# Altium schematic sheet SUP_VCCINT.SchDoc: AFCKU v1
size A4; Project: AMC FMC Carrier v4; Author: F. Świtakowski; CompanyName: WUT ISE; DrawnBy: F. Świtakowski; Organization: WUT ISE; Address1: PW ISE; Address2: Nowowiejska 15/19 00-665 Warsaw; Address3: gkasprow@gmail.com; DocumentNumber: 22; Revision: 1.0; SheetNumber: 18; SheetTotal: 21; ModifiedBy: -; CheckedDate: -; Title2: Power VCCINT, MGTAVCC; DivGrp: WUT ISE; Designer: F. Świtakowski; ModifiedDate: -; ProjectName: Sensor Box
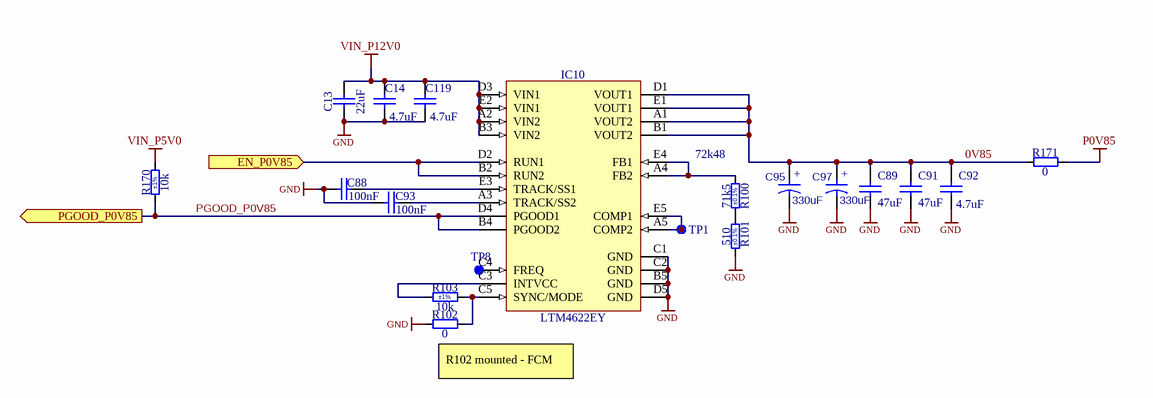
[diagram p0: SUP_VCCINT.SchDoc]

## Parts
C13  22uF  [CAPC3216X180N]
C14  4.7uF  [CAPC1709X95N]
C88  100nF  [CAPC1005X55N]
C89  47uF  [CAPC1608X100N]
C91  47uF  [CAPC1608X100N]
C92  4.7uF  [CAPC1709X95N]
C93  100nF  [CAPC1005X55N]
C95  330uF  [CAPMP3528X210N]
C97  330uF  [CAPMP3528X210N]
C119  4.7uF  [CAPC1709X95N]
IC10  LTM4622EY  [BGA25C127P5X5_625X625X262]
R100  71k5  Tolerance: ±0.1%  [RESC1608X55N]
R101  510  Tolerance: ±0.1%  [RESC2012X60N]
R102  0  [RESC1005X40N]
R103  10k  Tolerance: ±1%  [RESC1005X40N]
R170  10k  Tolerance: ±1%  [RESC1005X40N]
R171  0  [RESC6331X70N]
TP1  SMD Pad  [C75]  (value not drawn)  (no BOM)
TP8  SMD Pad  [C75]  (value not drawn)  (no BOM)

## Ports
EN_P0V85 (in), PGOOD_P0V85 (out)

## Nets
GND: C13.1 C14.1 C88.1 C89.1 C91.1 C92.1 C93.1 C95.2 C97.2 C119.1 IC10.B5(GND) IC10.C1(GND) IC10.C2(GND) IC10.D5(GND) R101.2 R102.1
P0V85: R171.2
VIN_P5V0: R170.2
VIN_P12V0: C13.2 C14.2 C119.2 IC10.A2(VIN2) IC10.B3(VIN2) IC10.D3(VIN1) IC10.E2(VIN1)
0V85: C89.2 C91.2 C92.2 C95.1 C97.1 IC10.A1(VOUT2) IC10.B1(VOUT2) IC10.D1(VOUT1) IC10.E1(VOUT1) R171.1
EN_P0V85: IC10.B2(RUN2) IC10.D2(RUN1) ; port EN_P0V85
PGOOD_P0V85: IC10.B4(PGOOD2) IC10.D4(PGOOD1) R170.1 ; port PGOOD_P0V85
NetC88_2: C88.2 IC10.E3(TRACK/SS1)
NetC93_2: C93.2 IC10.A3(TRACK/SS2)
NetIC10_A4: IC10.A4(FB2) IC10.E4(FB1) R100.1
NetIC10_A5: IC10.A5(COMP2) IC10.E5(COMP1) TP1.1
NetIC10_C3: IC10.C3(INTVCC) R103.1
NetIC10_C4: IC10.C4(FREQ) TP8.1
NetIC10_C5: IC10.C5(SYNC/MODE) R102.2 R103.2
NetR100_2: R100.2 R101.1

## Notes on the sheet
- (near R100) 72k48
- (near R102) R102 mounted - FCM
- Project/Equipment
- Document
- Designer
- Drawn by
- Check.by
- 01.20201
- PW ISE
- Contact
- File
- Last Mod.
- Print Date
- Sheet
- Size
- A4
- of
- Rev
- Copyright WUT ISE 2021.
  This documentation describes Open Hardware and is licensed under the CERN OHL v.1.2. You may redistribute and modify this documentation under the terms of the CERN OHL v.1.2. (http://ohwr.org/CERNOHL). This documentation is distributed WITHOUT ANY EXPRESS OR IMPLIED WARRANTY, INCLUDING OF MERCHANTABILITY, SATISFACTORY QUALITY AND FITNESS FOR A PARTICULAR PURPOSE. Please see the CERN OHL v.1.2 for applicable conditions.
- Nowowiejska 15/19 00-665 Warsaw
- (in symbol CTE3528-21_330UF_2.5V_20%_LESR0015_KEMET_T520) +

## Library data of the parts
C13 = CC1206_22UF_25V_20%_X5R: Non-polarised capacitor; Part Description: SMD Multilayer Chip Ceramic Capacitor; Manufacturer: GENERIC; Manufacturer1 Part Number: C3216X5R1E226M160; Voltage: 25V; TC: X5R; Tolerance: ±20%; Part Number: CC1206_22UF_25V_20%_X5R; Component Kind: Standard; Component Type: Standard; Pin Count: 2; Value: 22uF; Status: None; Manufacturer Part Number: CC1206_22UF_25V_20%_X5R; Case: 1206; Mounted: Yes; Socket: No; SMD: Yes; Sense: No; Manufacturer1 Example: TDK; Manufacturer1 ComponentHeight: 1.8mm; HelpURL: \\cern.ch\dfs\Applications\Altium\Datasheets\CC1206_X5R_TDK_C.pdf; Author: CERN DEM WB; CreateDate: 25.07.2018; LatestRevisionDate: 25.07.2018
C14 C92 C119 = CC0603_4.7UF_16V_10%_X5R: Non-polarised capacitor; Manufacturer: GENERIC; Part Description: SMD Multilayer Chip Ceramic Capacitor; Manufacturer1 Part Number: EMK107ABJ475KA-T; Tolerance: ±10%; Voltage: 16V; TC: X5R; Manufacturer Part Number: CC0603_4.7UF_16V_10%_X5R; Part Number: CC0603_4.7UF_16V_10%_X5R; Value: 4.7uF; Component Kind: Standard; Component Type: Standard; Pin Count: 2; Status: None; Case: 0603; Mounted: Yes; Socket: No; SMD: Yes; Sense: No; Manufacturer1 Example: TAIYO YUDEN; Manufacturer1 ComponentHeight: 0.95mm; HelpURL: \\cern.ch\dfs\Applications\Altium\Datasheets\CC0603_X7R_TAIYO-YUDEN_HIGH-VALUE.pdf; Author: CERN DEM JLC; CreateDate: 16/12/2013; LatestRevisionDate: 16/09/2014
C88 C93 = CC0402_100NF_16V_10%_X5R: Non-polarised capacitor; Part Description: SMD Multilayer Chip Ceramic Capacitor; Manufacturer: GENERIC; Manufacturer1 Part Number: GRM155R61C104KA88D; Voltage: 16V; TC: X5R; Tolerance: ±10%; Part Number: CC0402_100NF_16V_10%_X5R; Component Kind: Standard; Component Type: Standard; Pin Count: 2; Value: 100nF; Status: None; Manufacturer Part Number: CC0402_100NF_16V_10%_X5R; Case: 0402; Mounted: Yes; Socket: No; SMD: Yes; Sense: No; Manufacturer1 Example: MURATA; Manufacturer1 ComponentHeight: 0.55mm; HelpURL: \\cern.ch\dfs\Applications\Altium\Datasheets\CC0402_X5R_MURATA_GRM.pdf; Author: CERN DEM JLC; CreateDate: 10.12.2013; LatestRevisionDate: 10.12.2013
C89 C91 = CC0603_47UF_6.3V_20%_X5R: Non-polarised capacitor; Manufacturer: GENERIC; Part Description: SMD Multilayer Chip Ceramic Capacitor; Manufacturer1 Part Number: GRM188R60J476ME15D; Tolerance: ±20%; Voltage: 6.3V; TC: X5R; Manufacturer Part Number: CC0603_47UF_6.3V_20%_X5R; Part Number: CC0603_47UF_6.3V_20%_X5R; Value: 47uF; Component Kind: Standard; Component Type: Standard; Pin Count: 2; Status: None; Case: 0603; Mounted: Yes; Socket: No; SMD: Yes; Sense: No; Manufacturer1 Example: MURATA; Manufacturer1 ComponentHeight: 1mm; HelpURL: \\cern.ch\dfs\Applications\Altium\Datasheets\CC0603_MURATA_GRM188R60J476ME15D.pdf; Author: CERN DEM JLC; CreateDate: 01.02.2018; LatestRevisionDate: 01.02.2018
C95 C97 = CTE3528-21_330UF_2.5V_20%_LESR0015_KEMET_T520: Polarised capacitor; Part Description: Low ESR 0R015 Tantalum Chip Capacitor; Manufacturer: KEMET; Manufacturer Part Number: T520B337M2R5ATE015; Voltage: 2.5V; Tolerance: ±20%; Part Number: CTE3528-21_330UF_2.5V_20%_LESR0015_KEMET_T520; Component Kind: Standard; Component Type: Standard; Pin Count: 2; Value: 330uF; Status: None; Case: B; Mounted: Yes; Socket: No; SMD: Yes; Sense: No; ComponentHeight: 2.1mm; HelpURL: \\cern.ch\dfs\Applications\Altium\Datasheets\CTE-LESR_KEMET_T520.pdf; Author: CERN DEM JLC; CreateDate: 07.03.2012; LatestRevisionDate: 01.09.2014
IC10 = LTM4622EY: 3.6V-20V To 1.5V-12V, Dual 2A or Single 5A  Ultrathin Step-Down DC/DC µModule Regulator; Part Description: 3.6V-20V To 0.6V-5.5V, Dual 2.5A or Single 5A  Ultrathin Step-Down DC/DC uModule Regulator; Manufacturer: ANALOG DEVICES; PressFit: No; Bonding: No; Part Number: LTM4622EY; Component Kind: Standard; Component Type: Standard; Device: LTM4622EY; PackageDescription: BGA, 1.27mm Pitch, Square; 25 Pin, 5 Columns X 5 Rows, 6.25mm X 6.25mm X 2.62mm H; Manufacturer Part Number: LTM4622EY; Pin Count: 25; Case: BGA25; Mounted: Yes; Socket: No; SMD: Yes; Sense: No; ComponentHeight: 2.62mm; HelpURL: \\cern.ch\dfs\Applications\Altium\Datasheets\LTM4622EY.pdf; Author: CERN DEM HF; CreateDate: 01.12.2021; LatestRevisionDate: 01.12.2021
R100 = R0603_71K5_0.1%_0.063W_10PPM: Resistor - 0.1%; Part Description: Thin Film Chip Resistor; Manufacturer: GENERIC; Manufacturer1 Part Number: RN73C1J71K5BTDF; Power: 0.063W; TC: ±10ppm; PressFit: No; Part Number: R0603_71K5_0.1%_0.063W_10PPM; Component Kind: Standard; Component Type: Standard; Pin Count: 2; Value: 71k5; Status: Not Recommended; Manufacturer Part Number: R0603_71K5_0.1%_0.063W_10PPM; Case: 0603; Mounted: Yes; Sense: No; Socket: No; SMD: Yes; Manufacturer1 Example: TYCO HOLSWORTHY; Manufacturer1 ComponentHeight: 0.5mm; HelpURL: \\cern.ch\dfs\Applications\Altium\Datasheets\R0603_Tyco_RN73.pdf; Author: CERN DEM JLC; CreateDate: 03.12.2007; LatestRevisionDate: 13.03.2008
R101 = R0805_510R_0.1%_0.125W_10PPM: Resistor - 0.1%; Part Description: Thin Film Chip Resistor; Manufacturer: GENERIC; Manufacturer1 Part Number: RT0805BRB07510RL; Power: 0.125W; TC: ±10ppm; PressFit: No; Part Number: R0805_510R_0.1%_0.125W_10PPM; Component Kind: Standard; Component Type: Standard; Pin Count: 2; Value: 510; Status: Not Recommended; Manufacturer Part Number: R0805_510R_0.1%_0.125W_10PPM; Case: 0805; Mounted: Yes; Sense: No; Socket: No; SMD: Yes; Manufacturer1 Example: YAGEO PHYCOMP; Manufacturer1 ComponentHeight: 0.6mm; HelpURL: \\cern.ch\dfs\Applications\Altium\Datasheets\R0805_YAGEO_RT.pdf; Author: CERN DEM HF; CreateDate: 11.07.2022; LatestRevisionDate: 11.07.2022
R102 = R0402_0R_JUMPER: Resistor; Part Description: 1A (0.05R Max DC Resistance) Zero Ohm Jumper; Manufacturer: GENERIC; Manufacturer1 Part Number: 232270591001L; PressFit: No; Part Number: R0402_0R_JUMPER; Component Kind: Standard; Component Type: Standard; Pin Count: 2; Value: 0; Status: Not Recommended; Manufacturer Part Number: R0402_0R_JUMPER; Case: 0402; Mounted: Yes; Sense: No; Socket: No; SMD: Yes; Manufacturer1 Example: YAGEO PHYCOMP; Manufacturer1 ComponentHeight: 0.4mm; HelpURL: \\cern.ch\dfs\Applications\Altium\Datasheets\R0402_Phycomp_RC0402.pdf; Author: CERN DEM JLC; CreateDate: 03.12.2007; LatestRevisionDate: 17.10.2012
R103 R170 = R0402_10K_1%_0.0625W_100PPM: Resistor - 1%; Part Description: General Purpose Thick Film Chip Resistor; Manufacturer: GENERIC; Manufacturer1 Part Number: 232270671003L; TC: ±100ppm/°C; PressFit: No; Part Number: R0402_10K_1%_0.0625W_100PPM; Component Kind: Standard; Component Type: Standard; Pin Count: 2; Value: 10k; Status: Not Recommended; Power: 0.0625W; Manufacturer Part Number: R0402_10K_1%_0.0625W_100PPM; Case: 0402; Mounted: Yes; Sense: No; Socket: No; SMD: Yes; Manufacturer1 Example: YAGEO PHYCOMP; Manufacturer1 ComponentHeight: 0.4mm; HelpURL: \\cern.ch\dfs\Applications\Altium\Datasheets\R0402_Phycomp_RC0402.pdf; Author: CERN DEM JLC; CreateDate: 03.12.2007; LatestRevisionDate: 17.10.2012
R171 = R2512_0R_JUMPER: Resistor; Part Description: 16A (0.005R Max DC Resistance) Zero Ohm Jumper; Manufacturer: GENERIC; Manufacturer1 Part Number: CRCW25120000Z0EG; PressFit: No; Part Number: R2512_0R_JUMPER; Component Kind: Standard; Component Type: Standard; Pin Count: 2; Value: 0; Status: Preferred; Manufacturer Part Number: R2512_0R_JUMPER; Case: 2512; Mounted: Yes; Sense: No; Socket: No; SMD: Yes; Manufacturer1 Example: VISHAY DRALORIC; Manufacturer1 ComponentHeight: 0.7mm; HelpURL: \\cern.ch\dfs\Applications\Altium\Datasheets\R2512_VISHAY_CRCW-HP e3.pdf; Author: CERN DEM JLC; CreateDate: 17.09.2014; LatestRevisionDate: 17.09.2014
TP1 TP8 = SMD_PAD_D0.75MM: Through Hole Pad; Part Description: 0.75mm Diameter SMD Pad; Mounted: No; Part Number: SMD_PAD_D0.75MM; Component Type: Standard (No BOM); Pin Count: 1; Family: SMD Pad; Socket: No; SMD: No; Sense: No; Status: None; ComponentHeight: 0mm; HelpURL: Undefined; Author: CERN DEM BC; CreateDate: 04.06.2020; LatestRevisionDate: 04.06.2020; PackageDescription: 0.75mm Diameter SMD Pad